# Altium schematic sheet 555 LED BLINKER PCB BOARD1.SchDoc
size A4; SheetNumber: 1; SheetTotal: 1
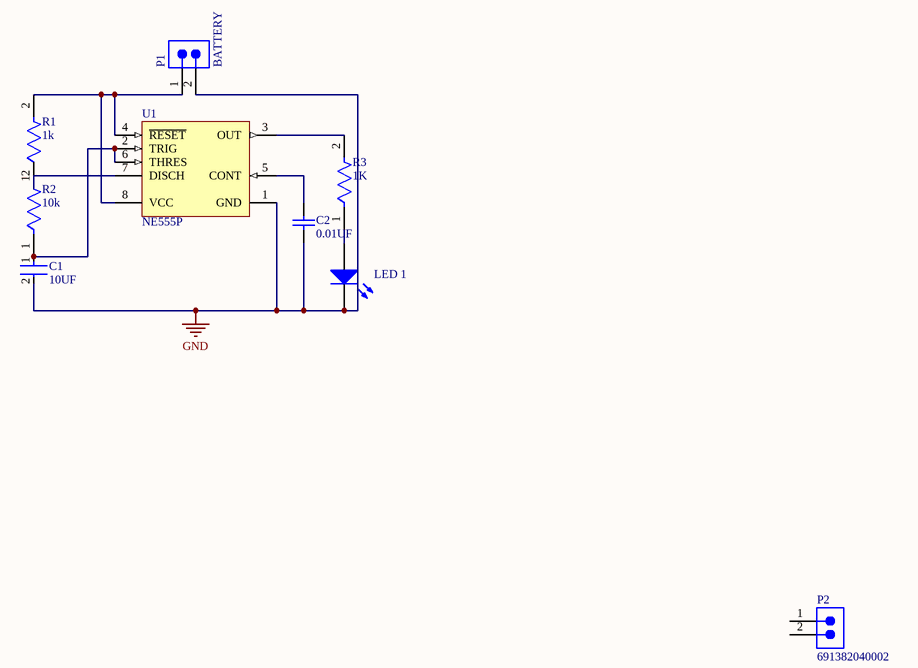
[diagram p0: 555 LED BLINKER PCB BOARD1.SchDoc]

## Parts
C1  10UF  [FP-CL31-IPC_C]
C2  0.01UF  [CAPC1608X92X38LL15T08]
LED_1  LED  (value not drawn)
P1  BATTERY  [691382040002]
P2  691382040002  [691382040002]
R1  1k  [FP-RN73R2B-MFG]
R2  10k  [FP-AT0805-MFG]
R3  1K  [FP-RN73R2B-MFG]
U1  NE555P  [P0008A]

## Nets
GND: C1.2 C2.1 LED_1.2(K) P1.2 U1.1(GND)
NetC1_1: C1.1 R2.1 U1.2(TRIG) U1.6(THRES)
NetC2_2: C2.2 U1.5(CONT)
NetLED_1_1: LED_1.1(A) R3.1
NetP1_1: P1.1 R1.2 U1.4(~{RESET}) U1.8(VCC)
NetR1_1: R1.1 U1.7(DISCH)
NetR3_2: R3.2 U1.3(OUT)

Not connected (* = marked no-connect by the designer): P2 1 2; R2 2

## Library data of the parts
C1 = CMP-13271-001546-1: Cap Ceramic 10uF 16V X5R ±10% SMD 1206 +85°C Embossed T/R; Tolerance: 10%; Case/Package: 1206; Mount: Surface Mount; Depth: 1.6mm; Capacitance: 10uF; Max Operating Temperature: 85°C; Length: 3.2mm; Packaging: Tape and Reel; Dielectric: X5R; Radiation Hardening: No; Min Operating Temperature: -55°C; Case Code (Imperial): 1206; Voltage Rating: 16V; Height: 0.85mm; Thickness: 0.037inch; Case Code (Metric): 3216; Width: 0.063inch
C2 = CMP-1035-02320-2: Part Number: VJ0603Y103JXAAC; Manufacturer: Vitramon
LED_1 = LED: Light-Emitting Diode; AF: 1; BV: 0; BV_MAX: 1e99; EG: 1.11; FC: 0.5; IBV: 0.001; IS: 1e-14; MJSW: 0.33; NTUN: 30; TNOM: 27; XTI: 3; SimulationGenericComponent: True; CJO: 0; CJP: 0; CTA: 0; CTP: 0; FCS: 0.5; FV_MAX: 1e99; IKF: 0; IKR: 0; ISR: 1e-14; JSW: 0; JTUN: 0; JTUNSW: 0; KEG: 1; KF: 0; LEVEL: 1; N: 1; NBV: 1; NR: 1; NS: 1; PHP: 1; RS: 0; TCV: 0; TLEV: 0; TLEVC: 0; TM1: 0; TM2: 0; TPB: 0; TPHP: 0; TRS: 0; TRS2: 0; TT: 0; TTT1: 0; TTT2: 0; VJ: 1; XTITUN: 3
P1 P2 = CMP-1502-01759-3: Terminal Block, 2.50MM Pitch, Horizontal Pcb Header, Flanges, 300VAC, 2 Pins; Current: 12A; Number of Positions Per Level: 2; Voltage: 300V; Number of Levels: 1; Gender: Male; Pitch: 2.4892mm; Max Operating Temperature: 105°C; Lead Pitch: 2.5mm; Min Operating Temperature: -40°C; Number of Pins: 2; Color: Green; Packaging: Box; RoHS: Compliant; Mount: Through Hole; Contact Plating: Tin; Termination: Solder; Number of Positions: 2
R1 R3 = CMP-04015-029161-1: 1kΩ ±1% 0.25W, 1/4W Chip Resistor 1206 (3216 Metric) Moisture Resistant Thin Film
R2 = CMP-03412-049031-1: Thin Film Chip Resistors Automotive Grade 10kΩ 0.5% 50ppm/°C 0805; Max Power Dissipation: 125mW; Resistance: 10kR; Ratings: AEC-Q200; Length: 0.079inch; Temperature Coefficient: 50ppm/°C; Height: 0.024inch; Min Operating Temperature: -55°C; Case/Package: 0805; Tolerance: 0.5%; RoHS Compliant: Yes; Features: Moisture Resistant; Number of Terminations: 2; Max Operating Temperature: 155°C; Series: AT; Packaging: Tape and Reel; Width: 0.049inch; Resistor Type: Thin Film
U1 = CMP-2000-04954-1: Precision Timer, 4.5 to 16 V, 0 to 70 degC, 8-Pin DIP, Pb-Free, Tube; Manufacturer: TexasInstruments; Maximum High Level Output Current: -200mA; Number of Internal Timers: 1; Operating Supply Voltage: 5; Maximum Low Level Output Current: 200mA; Rad Hard: No; Packaging: Rail/Tube; Manufacturer URL: http://www.ti.com/; Package Reference: P8; Package Description: 8-Pin Double In-line Package, Body 9.59 x 6.35 mm, Pitch 2.54 mm; Package URL: http://www.ti.com/lit/ml/mpdi001b/mpdi001b.pdf; Type: Standard; Datasheet URL: http://www.ti.com/general/docs/lit/getliterature.tsp?genericPartNumber=NE555&fileType=pdf; Category: Timer; Package: 8PDIP; Datasheet Version: Rev. I, 09/2014